# Altium project PCB_CHongTromSim808.PrjPcb
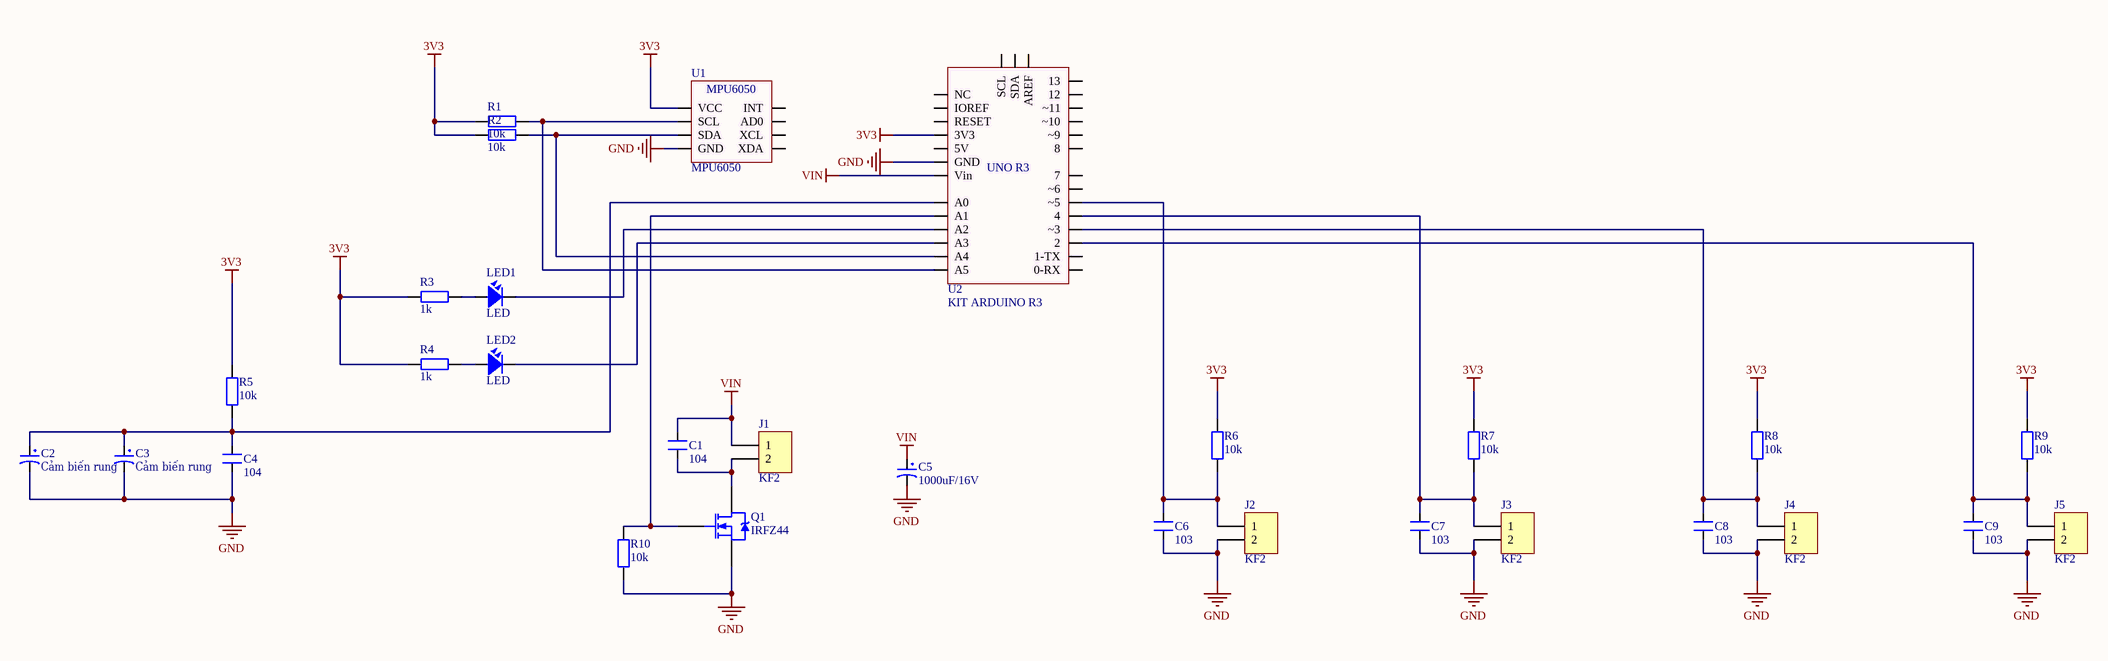
[diagram p0: ChongTromSim808.SchDoc]
1 sheet, 29 parts. Net scope: global (net labels, ports and power ports of the same name join across sheets).
Board file: ChongTromSim808.PcbDoc

## Sheet ChongTromSim808.SchDoc
size A0

### Parts
C1  104  [CN2]
C2  Cảm biến rung  [CP1.5/3.4]
C3  Cảm biến rung  [CP1.5/3.4]
C4  104  [CN2]
C5  1000uF/16V  [CP1.5/3.4]
C6  103  [SM-0805]
C7  103  [SM-0805]
C8  103  [SM-0805]
C9  103  [SM-0805]
J1  KF2  [KF2-3.5]
J2  KF2  [KF2-3.5]
J3  KF2  [KF2-3.5]
J4  KF2  [KF2-3.5]
J5  KF2  [KF2-3.5]
LED1  LED  [LED-5-WHITE]
LED2  LED  [LED-5-BLUE]
Q1  IRFZ44  [TO220-123]
R1  10k  [RES-1/4W]
R2  10k  [RES-1/4W]
R3  1k  [RES-1/4W]
R4  1k  [RES-1/4W]
R5  10k  [RES-1/4W]
R6  10k  [RES-1/4W]
R7  10k  [RES-1/4W]
R8  10k  [RES-1/4W]
R9  10k  [RES-1/4W]
R10  10k  [RES-1/4W]
U1  MPU6050  [MPU6050]
U2  KIT ARDUINO R3  [Arduino UNO R3 - v1]

### Nets
3V3: R1.1 R2.1 R3.1 R4.1 R5.2 R6.2 R7.2 R8.2 R9.2 U1.1(VCC) U2.3V3
GND: C2.2 C3.2 C4.1 C5.2 C6.1 C7.1 C8.1 C9.1 J2.2 J3.2 J4.2 J5.2 Q1.3(S) R10.1 U1.2(GND) U2.GND
VIN: C1.2 C5.1 J1.1 U2.Vin
NetC1_1: C1.1 J1.2 Q1.2(D)
NetC2_1: C2.1 C3.1 C4.2 R5.1 U2.A0
NetC6_2: C6.2 J2.1 R6.1 U2.~5
NetC7_2: C7.2 J3.1 R7.1 U2.4
NetC8_2: C8.2 J4.1 R8.1 U2.~3
NetC9_2: C9.2 J5.1 R9.1 U2.2
NetLED1_1: LED1.1 R3.2
NetLED1_2: LED1.2 U2.A2
NetLED2_1: LED2.1 R4.2
NetLED2_2: LED2.2 U2.A3
NetQ1_1: Q1.1(G) R10.2 U2.A1
NetR1_2: R1.2 U1.3(SCL) U2.A5
NetR2_2: R2.2 U1.4(SDA) U2.A4

Not connected (* = marked no-connect by the designer): U1 5(XDA) 6(XCL) 7(AD0) 8(INT); U2 0-RX 1-TX 5V 7 8 12 13 AREF IOREF NC RESET SCL SDA ~6 ~9 ~10 ~11

### Notes on the sheet
- (in symbol KIT ARDUINO R3) UNO R3

### Library data of the parts
C1 C4 = CN2: Cap np 104 => 105pF; Value: 0.1uF
C2 C3 = CP3: Cap 100uF/35V - 470uF/16V; Value: 100uF/35V/50V; Description 1: 1000uF/6,3V - 470uF/16V - 330uF - 25V; Description 2: 220uF/35V - 100uF/50V - 63V - 4,7uF/200V; Description 3: 22uF => 33uF100V - 3,3uF => 4,7uF/250V; Description 4: 2,2uF =>3,3uF/350 - 2,2uF/400V - 1uF/450V
C5 = CP4: Cap 1000uF/16V - 220uF/50V; Description 5: 4,7uF>10uF/250V_3,3uF>10uF/400V - 2,2uF>4,7uF/450V; Description 1: 2200uF-3300uF/6,3V - 1000uF-2200uF/10V; Description 2: 1000uF/16V - 470uF => 1000uF/25V - 100uF/100V; Description 3: 330uF>470uF/35V_220uF>470uF/50V_10uF>22uF/250V; Description 4: 220uF => 330uF/63V - 10uF =>33uF/160 - 200V; Value: 1000uF/16V
C6-C9 = CM: Cap SMD; Value: 103
J1-J5 = KF2: Manufacturer: Würth Elektronik eiSos GmbH; partNo: 691103110002; ComponentLink1 Description: Manufacturer; ComponentLink2 Description: Datasheet; NoPins: 2; Created Date: 29 October 2013; ComponentLink1URL: http://www.we-online.com; ComponentLink2URL: http://katalog.we-online.de/em/datasheet/6911031100xx.pdf; Created by: Karrer Zheng
Q1 = IRFZ44: Value: IRF840
R1-R10 = R: Resistor R1/4W
U2 = KIT ARDUINO R3: ARDUINO  R3 ATMEGA328, ARDUINO UNO, EVAL BOARD